# Altium schematic sheet OCTOSPI_FLASH.SchDoc: OCTOSPI FLASH
size A4; Date: Not used; ApprovedBy: Not used; CheckedBy: Not used; Author: Not used; CompanyName: STMicroelectronics; DrawnBy: Not used; Engineer: Not used; Organization: Not used; Address1: Not used; Address2: Not used; Address3: Not used; Address4: Not used; DocumentNumber: Not used; Revision: Not used; SheetNumber: 6; SheetTotal: 16; CurrentTime: Not used; CurrentDate: Not used; Time: Not used; DocumentFullPathAndName: Not used; DocumentName: Not used; ModifiedDate: Not used; ImagePath: Not used; ProjectName: Not used; Application_BuildNumber: Not used
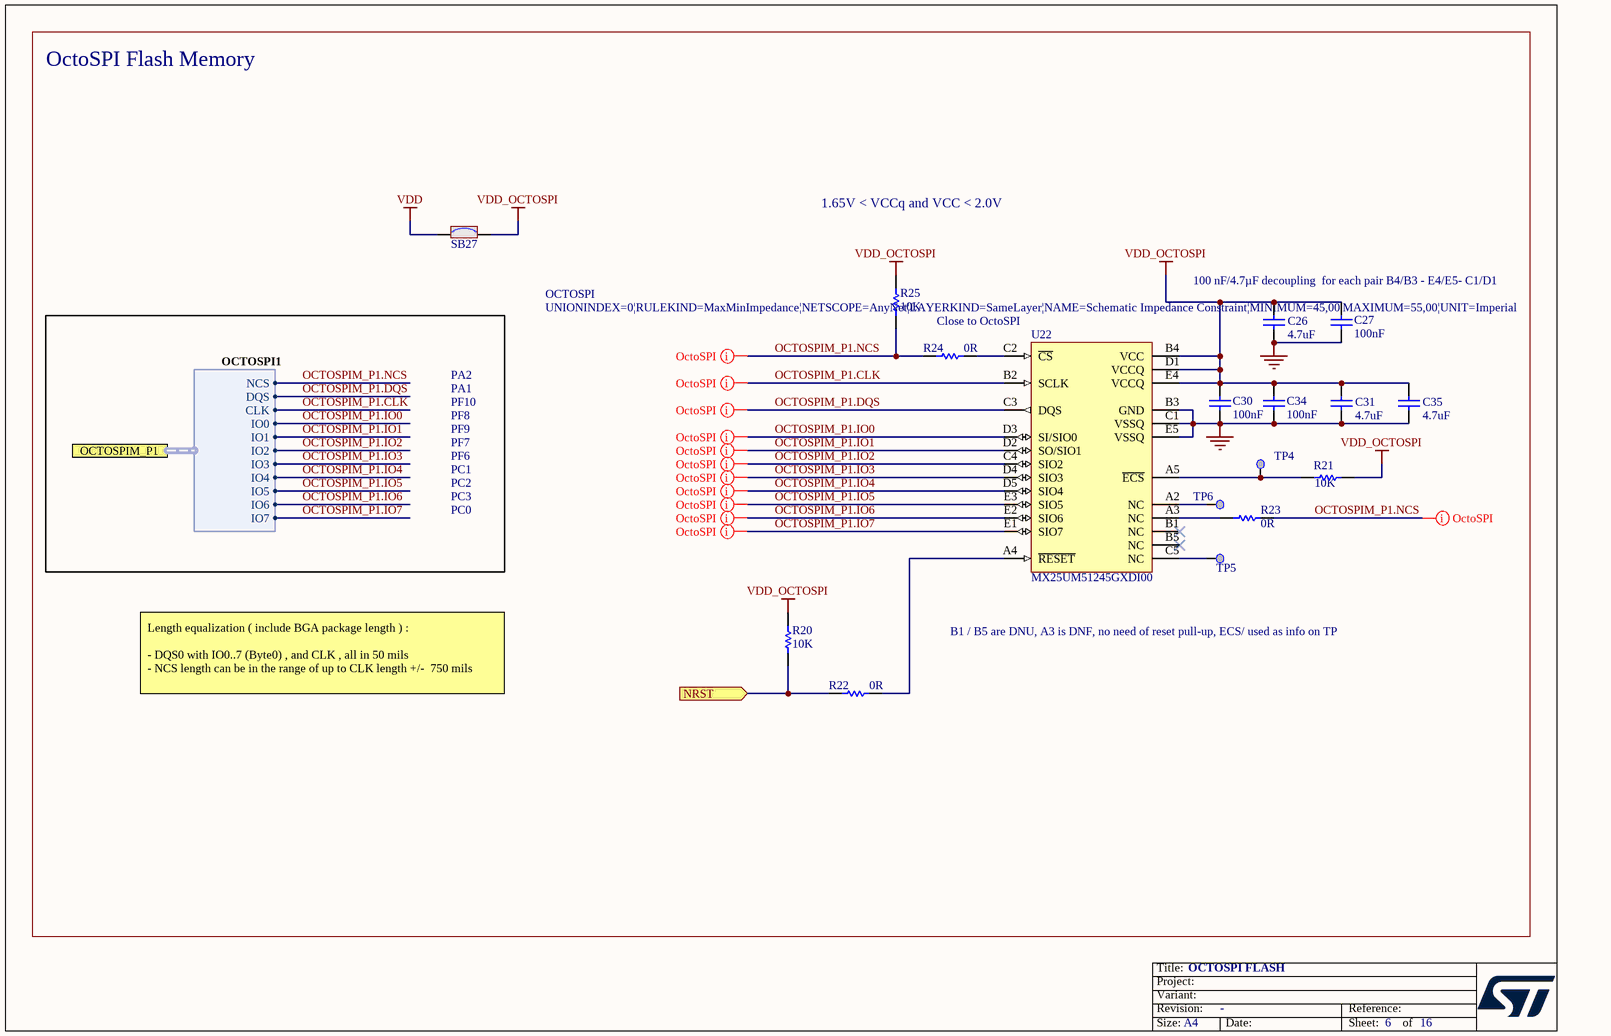
[diagram p0: OCTOSPI_FLASH.SchDoc]

## Parts
C26  value 4.7uF  [C0603]  (hidden comment: Capacitor)
C27  value 100nF  [C0402]  (hidden comment: Capacitor)
C30  value 100nF  [C0402]  (hidden comment: Capacitor)
C31  value 4.7uF  [C0603]  (hidden comment: Capacitor)
C34  value 100nF  [C0402]  (hidden comment: Capacitor)
C35  value 4.7uF  [C0603]  (hidden comment: Capacitor)
R20  value 10K  [R0402]  (hidden comment: Resistor)
R21  value 10K  [R0402]  (hidden comment: Resistor)
R22  value 0R  [R0402]  (hidden comment: Resistor)
R23  value 0R  [R0402]  (hidden comment: Resistor)
R24  value 0R  [R0402]  (hidden comment: Resistor)
R25  value 10K  [R0402]  (hidden comment: Resistor)
SB27  SB_ON  [SOLDER-BRIDGE_R0402-0R]  (value not drawn)
TP4  Test Point  [TP_SMD_1MM]  (value not drawn)  (no BOM)
TP5  Test Point  [TP_SMD_1MM]  (value not drawn)  (no BOM)
TP6  Test Point  [TP_SMD_1MM]  (value not drawn)  (no BOM)
U22  value MX25UM51245GXDI00  [ICC_BGA24_5X5-BALL-ARRAY_6X8_P1]  (hidden comment: MX25xx51245GXDx00)

## Ports
NRST (in), OCTOSPIM_P1 (harness OCTOSPI1)

## Harnesses
OCTOSPI1: IO1, IO0, CLK, NCS, IO2, IO3, IO5, IO4, IO6, IO7, DQS

## Nets
GND: C26.1 C27.1 C30.1 C31.1 C34.1 C35.1 U22.B3(GND) U22.C1(VSSQ) U22.E5(VSSQ)
VDD: SB27.1
VDD_OCTOSPI: C26.2 C27.2 C30.2 C31.2 C34.2 C35.2 R20.2 R21.2 R25.2 SB27.2 U22.B4(VCC) U22.D1(VCCQ) U22.E4(VCCQ)
NRST: R20.1 R22.1 ; port NRST
OCTOSPIM_P1.CLK: U22.B2(SCLK) ; port OCTOSPIM_P1.CLK
OCTOSPIM_P1.DQS: U22.C3(DQS) ; port OCTOSPIM_P1.DQS
OCTOSPIM_P1.IO0: U22.D3(SI/SIO0) ; port OCTOSPIM_P1.IO0
OCTOSPIM_P1.IO1: U22.D2(SO/SIO1) ; port OCTOSPIM_P1.IO1
OCTOSPIM_P1.IO2: U22.C4(SIO2) ; port OCTOSPIM_P1.IO2
OCTOSPIM_P1.IO3: U22.D4(SIO3) ; port OCTOSPIM_P1.IO3
OCTOSPIM_P1.IO4: U22.D5(SIO4) ; port OCTOSPIM_P1.IO4
OCTOSPIM_P1.IO5: U22.E3(SIO5) ; port OCTOSPIM_P1.IO5
OCTOSPIM_P1.IO6: U22.E2(SIO6) ; port OCTOSPIM_P1.IO6
OCTOSPIM_P1.IO7: U22.E1(SIO7) ; port OCTOSPIM_P1.IO7
OCTOSPIM_P1.NCS: R23.2 R24.1 R25.1 ; port OCTOSPIM_P1.NCS
NetR21_1: R21.1 TP4.1 U22.A5(~{ECS})
NetR22_2: R22.2 U22.A4(~{RESET})
NetR23_1: R23.1 U22.A3(NC)
NetR24_2: R24.2 U22.C2(~{CS})
NetTP5_1: TP5.1 U22.C5(NC)
NetTP6_1: TP6.1 U22.A2(NC)

Not connected (* = marked no-connect by the designer): U22 B1(NC)* B5(NC)*

## Layout directives
rule Matched Net Lengths [Tolerance = 20mil]; net class OCTOSPI; rule Impedance Constraint [Min = 45.00    Max = 55.00    ]; rule Routing Layers [TopLayer - Enabled BottomLayer - Enabled ]: OCTOSPIM_P1.CLK, OCTOSPIM_P1.DQS, OCTOSPIM_P1.IO0, OCTOSPIM_P1.IO1, OCTOSPIM_P1.IO2, OCTOSPIM_P1.IO3, OCTOSPIM_P1.IO4, OCTOSPIM_P1.IO5, OCTOSPIM_P1.IO6, OCTOSPIM_P1.IO7, OCTOSPIM_P1.NCS
rule Matched Net Lengths [Tolerance = 500mil]; net class OCTOSPI; rule Impedance Constraint [Min = 45.00    Max = 55.00    ]; rule Routing Layers [TopLayer - Enabled BottomLayer - Enabled ]: OCTOSPIM_P1.NCS

## Notes on the sheet
- OctoSPI Flash Memory
- 1.65V < VCCq and VCC < 2.0V
- 100 nF/4.7µF decoupling  for each pair B4/B3 - E4/E5- C1/D1
- PA2
- Close to OctoSPI
- PF7
- PF9
- PF8
- PF10
- PA1
- PC0
- PC1
- PC3
- PC2
- PF6
- B1 / B5 are DNU, A3 is DNF, no need of reset pull-up, ECS/ used as info on TP
- Length equalization ( include BGA package length ) :
  - DQS0 with IO0..7 (Byte0) , and CLK , all in 50 mils
  - NCS length can be in the range of up to CLK length +/-  750 mils
- Title:
- Project:
- Size:
- Revision:
- Variant:
- A4
- -
- Date:
- Reference:
- Sheet:
- of

## Library data of the parts
C26 C31 C35 = MCD-00009: Capacitor, MLCC, 4.7uF, 16V, X5R, +/-10%, 0603, T=0.8mm; Manufacturer_Part_Number: CC0603KRX5R7BB475; Manufacturer: YAGEO; Part_Preference: Recommended; Component_Country_Of_Origin: China; Internal_Part_Number: MCD-00009; Status: Released; Part_Type: Capacitor; Package: 0603; ComponentLink1URL: http://tunmcdsvn.tun.st.com/Component_Documentation_Library/Trunk/Capacitor/YAGEO_X5R_Series; Order_Code_Digikey: 311-1785-1-ND; Order_Code_Farnell: N/A; Order_Code_RS: N/A
C27 C30 C34 = MCD-00006: Capacitor, MLCC, 100nF, 16V, X7R, +/-10%, 0402, T=0.5mm; Manufacturer_Part_Number: CC0402KRX7R7BB104; Manufacturer: YAGEO; Part_Preference: Recommended; Order_Code_RS: 616-9701; Component_Country_Of_Origin: China; Internal_Part_Number: MCD-00006; Status: Released; Part_Type: Capacitor; Package: 0402; ComponentLink1URL: http://tunmcdsvn.tun.st.com/Component_Documentation_Library/Trunk/Capacitor/YAGEO_X7R_Series; Order_Code_Digikey: 311-1338-1-ND; Order_Code_Farnell: 9402047
R20 R21 R25 = MCD-00053: Resistor, 10K, 0402, +/-1%, 1/16W; Manufacturer_Part_Number: RC0402FR-0710KL; Manufacturer: YAGEO; BMS_Part_Number: 9131590; Part_Preference: Recommended; Component_Country_Of_Origin: China; Internal_Part_Number: MCD-00053; Status: Released; Part_Type: Resistor; ComponentLink1URL: http://tunmcdsvn.tun.st.com/Component_Documentation_Library/Trunk/Resistor/YAGEO_RC_L_Series; Package: 0402; Order_Code_Digikey: 311-10.0KLRCT-ND; Order_Code_Farnell: 9239359; Order_Code_RS: N/A
R22-R24 = MCD-00052: Resistor, 0R, 0402, +/-5%, 1/16W; Manufacturer_Part_Number: RC0402JR-070RL; Manufacturer: YAGEO; Part_Preference: Recommended; Order_Code_RS: 618-5804; Component_Country_Of_Origin: China; Internal_Part_Number: MCD-00052; Status: Released; Part_Type: Resistor; Package: 0402; ComponentLink1URL: http://tunmcdsvn.tun.st.com/Component_Documentation_Library/Trunk/Resistor/YAGEO_RC_L_Series; Order_Code_Digikey: 311-0.0JRCT-ND; Order_Code_Farnell: 9232516RL
SB27 = MCD-01618: Solder Bridge 0402 ON; Part_Type: Misc; Manufacturer_Part_Number: RC0402JR-070RL; Manufacturer: YAGEO; Part_Preference: Recommended; Order_Code_RS: 618-5804; Component_Country_Of_Origin: China; Internal_Part_Number: MCD-01618; Status: Released; Package: SB0402; ComponentLink1URL: http://tunmcdsvn.tun.st.com/Component_Datasheet_Library/Trunk/Resistors/Yageo_Resistor_RC0402-series; Order_Code_Digikey: 311-0.0JRTR-ND; Order_Code_Farnell: 2363467
TP4-TP6 = MCD-00074: Test Point 1mm; Part_Type: Misc; Part_Preference: Recommended; Internal_Part_Number: MCD-00074; Status: Released; Manufacturer_Part_Number: N/A; Manufacturer: N/A; ComponentLink1URL: http://na; Order_Code_Digikey: N/A; Order_Code_Farnell: N/A; Order_Code_RS: N/A
U22 = MCD-02166: Memory,Octo-SPI-NOR,512Mb,x1/x8,133/200MHz,1.8V,DTR,BGA24, CMOS MXSMIO; Part_Type: IC; Manufacturer: MACRONIX; Part_Preference: Recommended; Component_Country_Of_Origin: Unknown; Internal_Part_Number: MCD-02166; Status: Checked; Manufacturer_Part_Number: MX25UM51245GXDI00; Package: BGA24; ComponentLink1URL: http://tunmcdsvn.tun.st.com/Component_Datasheet_Library/Trunk/IC/Macronix_OctoSPI_NOR_512Mb_MX25UM51245GXDI00; Order_Code_Digikey: 1092-1253-ND; Order_Code_Farnell: 3129239; Order_Code_RS: N/A